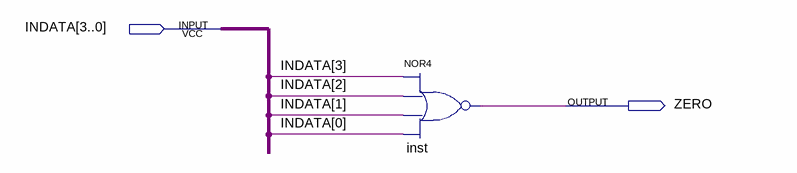
[diagram p0: schematic sheet]
// Quartus schematic ZERO_DET.bdf as structural Verilog: 1 symbols, 2 pins
module ZERO_DET (
  input  [3:0] INDATA,
  output ZERO
);

  nor inst (ZERO, INDATA[3], INDATA[2], INDATA[1], INDATA[0]);
endmodule
